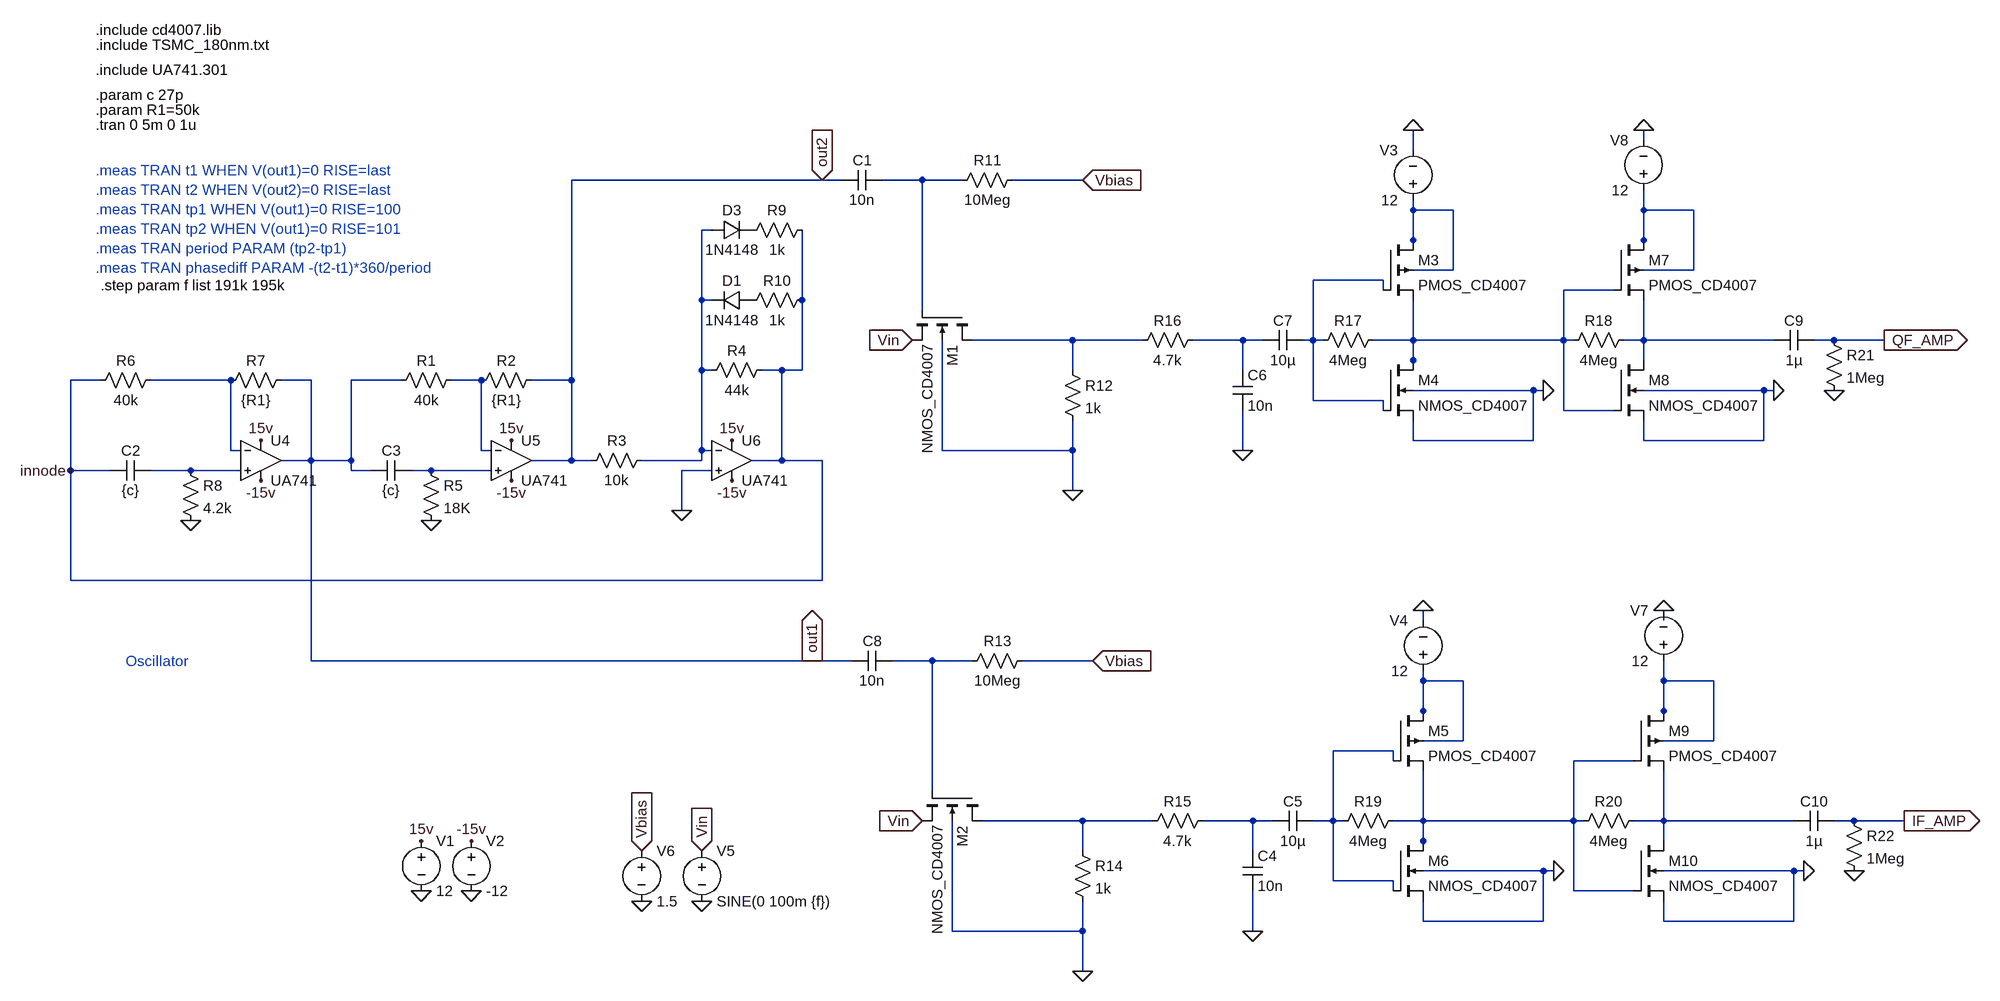
[diagram p0: schematic amplified_output_QDC.asc]
amplified_output_QDC.asc, the LTspice schematic file:
Version 4.1
SHEET 1 3980 1540
WIRE 2224 -368 2224 -384
WIRE 1856 -352 1856 -384
WIRE 912 -304 512 -304
WIRE 944 -304 912 -304
WIRE 1072 -304 1008 -304
WIRE 1136 -304 1072 -304
WIRE 1328 -304 1216 -304
WIRE 1856 -256 1856 -272
WIRE 1920 -256 1856 -256
WIRE 2224 -256 2224 -288
WIRE 2304 -256 2224 -256
WIRE 736 -224 720 -224
WIRE 1856 -208 1856 -256
WIRE 2224 -208 2224 -256
WIRE 1856 -192 1856 -208
WIRE 2224 -192 2224 -208
WIRE 1920 -160 1920 -256
WIRE 1920 -160 1856 -160
WIRE 2304 -160 2304 -256
WIRE 2304 -160 2224 -160
WIRE 1808 -144 1696 -144
WIRE 1808 -128 1808 -144
WIRE 2176 -128 2096 -128
WIRE 720 -112 720 -224
WIRE 736 -112 720 -112
WIRE 880 -112 880 -224
WIRE 1072 -96 1072 -304
WIRE 1312 -48 1152 -48
WIRE 1424 -48 1312 -48
WIRE 1584 -48 1504 -48
WIRE 1616 -48 1584 -48
WIRE 1696 -48 1696 -144
WIRE 1696 -48 1680 -48
WIRE 1712 -48 1696 -48
WIRE 1856 -48 1856 -112
WIRE 1856 -48 1792 -48
WIRE 2096 -48 2096 -128
WIRE 2096 -48 1856 -48
WIRE 2112 -48 2096 -48
WIRE 2224 -48 2224 -112
WIRE 2224 -48 2192 -48
WIRE 2432 -48 2224 -48
WIRE 2528 -48 2496 -48
WIRE 2608 -48 2528 -48
WIRE 1856 -16 1856 -48
WIRE 2224 -16 2224 -48
WIRE 720 0 720 -112
WIRE 736 0 720 0
WIRE 848 0 816 0
WIRE 880 0 880 -112
WIRE 880 0 848 0
WIRE 1312 0 1312 -48
WIRE 1584 0 1584 -48
WIRE 1856 0 1856 -16
WIRE -240 16 -288 16
WIRE -32 16 -160 16
WIRE 96 16 48 16
WIRE 240 16 160 16
WIRE 368 16 320 16
WIRE 512 16 512 -304
WIRE 512 16 448 16
WIRE 2048 32 1856 32
WIRE 2064 32 2048 32
WIRE 2416 32 2224 32
WIRE 2432 32 2416 32
WIRE 1696 48 1696 -48
WIRE 1808 48 1696 48
WIRE 1808 64 1808 48
WIRE 2096 64 2096 -48
WIRE 2176 64 2096 64
WIRE 1856 112 1856 80
WIRE 2048 112 2048 32
WIRE 2048 112 1856 112
WIRE 2224 112 2224 80
WIRE 2416 112 2416 32
WIRE 2416 112 2224 112
WIRE -32 128 -32 16
WIRE -16 128 -32 128
WIRE 368 128 368 16
WIRE 384 128 368 128
WIRE 720 128 720 0
WIRE 736 128 720 128
WIRE 1104 128 1104 -48
WIRE 1312 128 1312 80
WIRE 1312 128 1104 128
WIRE 1584 128 1584 64
WIRE 96 144 96 16
WIRE 96 144 48 144
WIRE 160 144 160 16
WIRE 160 144 96 144
WIRE 512 144 512 16
WIRE 512 144 448 144
WIRE 544 144 512 144
WIRE 720 144 720 128
WIRE 720 144 624 144
WIRE 848 144 848 0
WIRE 848 144 800 144
WIRE 912 144 848 144
WIRE -288 160 -288 16
WIRE -224 160 -288 160
WIRE -96 160 -160 160
WIRE -16 160 -96 160
WIRE 160 160 160 144
WIRE 192 160 160 160
WIRE 288 160 256 160
WIRE 384 160 288 160
WIRE 736 160 688 160
WIRE 1312 192 1312 128
WIRE 688 224 688 160
WIRE -288 336 -288 160
WIRE 912 336 912 144
WIRE 912 336 -288 336
WIRE 1872 400 1872 384
WIRE 2256 400 2256 384
WIRE 96 464 96 144
WIRE 896 464 96 464
WIRE 960 464 896 464
WIRE 1088 464 1024 464
WIRE 1152 464 1088 464
WIRE 1344 464 1232 464
WIRE 1872 496 1872 480
WIRE 1936 496 1872 496
WIRE 2256 496 2256 464
WIRE 2336 496 2256 496
WIRE 1872 544 1872 496
WIRE 2256 544 2256 496
WIRE 1872 560 1872 544
WIRE 2256 560 2256 544
WIRE 1936 592 1936 496
WIRE 1936 592 1872 592
WIRE 2336 592 2336 496
WIRE 2336 592 2256 592
WIRE 1824 608 1728 608
WIRE 1824 624 1824 608
WIRE 2208 624 2112 624
WIRE 1088 672 1088 464
WIRE 1328 720 1168 720
WIRE 1440 720 1328 720
WIRE 1600 720 1520 720
WIRE 1632 720 1600 720
WIRE 1728 720 1728 608
WIRE 1728 720 1696 720
WIRE 1744 720 1728 720
WIRE 1872 720 1872 640
WIRE 1872 720 1824 720
WIRE 2112 720 2112 624
WIRE 2112 720 1872 720
WIRE 2128 720 2112 720
WIRE 2256 720 2256 640
WIRE 2256 720 2208 720
WIRE 2464 720 2256 720
WIRE 2560 720 2528 720
WIRE 2640 720 2560 720
WIRE 1872 752 1872 720
WIRE 2256 752 2256 720
WIRE 1328 768 1328 720
WIRE 1600 768 1600 720
WIRE 1872 768 1872 752
WIRE 2064 800 1872 800
WIRE 2080 800 2064 800
WIRE 2464 800 2256 800
WIRE 2480 800 2464 800
WIRE 1728 816 1728 720
WIRE 1824 816 1728 816
WIRE 1824 832 1824 816
WIRE 2112 832 2112 720
WIRE 2208 832 2112 832
WIRE 1872 880 1872 848
WIRE 2064 880 2064 800
WIRE 2064 880 1872 880
WIRE 2256 880 2256 848
WIRE 2464 880 2464 800
WIRE 2464 880 2256 880
WIRE 1120 896 1120 720
WIRE 1328 896 1328 848
WIRE 1328 896 1120 896
WIRE 1600 896 1600 832
WIRE 1328 960 1328 896
FLAG 688 224 0
FLAG 288 240 0
FLAG -96 240 0
FLAG 272 752 15v
FLAG 16 112 15v
FLAG 416 112 15v
FLAG 768 112 15v
FLAG 352 752 -15v
FLAG 768 176 -15v
FLAG 272 832 0
FLAG 352 832 0
FLAG 16 176 -15v
FLAG 416 176 -15v
FLAG 912 -304 out2
IOPIN 912 -304 In
FLAG 1328 -304 Vbias
IOPIN 1328 -304 In
FLAG 1056 -48 Vin
IOPIN 1056 -48 In
FLAG 1312 192 0
FLAG 1856 -384 0
FLAG 2064 32 0
FLAG 2640 720 IF_AMP
IOPIN 2640 720 Out
FLAG 720 848 0
FLAG 720 768 Vin
IOPIN 720 768 In
FLAG 624 848 0
FLAG 624 768 Vbias
IOPIN 624 768 In
FLAG -288 160 innode
FLAG 1584 128 0
FLAG 2224 -384 0
FLAG 2432 32 0
FLAG 2608 -48 QF_AMP
IOPIN 2608 -48 Out
FLAG 1344 464 Vbias
IOPIN 1344 464 In
FLAG 1072 720 Vin
IOPIN 1072 720 In
FLAG 1328 960 0
FLAG 1872 384 0
FLAG 2080 800 0
FLAG 1600 896 0
FLAG 2256 384 0
FLAG 2480 800 0
FLAG 896 464 out1
IOPIN 896 464 Out
FLAG 2528 32 0
FLAG 2560 800 0
SYMBOL res 336 0 R90
WINDOW 0 0 56 VBottom 2
WINDOW 3 32 56 VTop 2
SYMATTR InstName R1
SYMATTR Value 40k
SYMBOL res 464 0 R90
WINDOW 0 0 56 VBottom 2
WINDOW 3 32 56 VTop 2
SYMATTR InstName R2
SYMATTR Value {R1}
SYMBOL res 640 128 R90
WINDOW 0 0 56 VBottom 2
WINDOW 3 32 56 VTop 2
SYMATTR InstName R3
SYMATTR Value 10k
SYMBOL res 832 -16 R90
WINDOW 0 0 56 VBottom 2
WINDOW 3 32 56 VTop 2
SYMATTR InstName R4
SYMATTR Value 44k
SYMBOL res 272 144 R0
SYMATTR InstName R5
SYMATTR Value 18K
SYMBOL res -144 0 R90
WINDOW 0 0 56 VBottom 2
WINDOW 3 32 56 VTop 2
SYMATTR InstName R6
SYMATTR Value 40k
SYMBOL res 64 0 R90
WINDOW 0 0 56 VBottom 2
WINDOW 3 32 56 VTop 2
SYMATTR InstName R7
SYMATTR Value {R1}
SYMBOL cap -160 144 R90
WINDOW 0 0 32 VBottom 2
WINDOW 3 32 32 VTop 2
SYMATTR InstName C2
SYMATTR Value {c}
SYMBOL res -112 144 R0
SYMATTR InstName R8
SYMATTR Value 4.2k
SYMBOL voltage 272 736 R0
SYMATTR InstName V1
SYMATTR Value 12
SYMBOL voltage 352 736 R0
WINDOW 123 0 0 Left 0
WINDOW 39 0 0 Left 0
SYMATTR InstName V2
SYMATTR Value -12
SYMBOL cap 256 144 R90
WINDOW 0 0 32 VBottom 2
WINDOW 3 32 32 VTop 2
SYMATTR InstName C3
SYMATTR Value {c}
SYMBOL diode 800 -128 R90
WINDOW 0 0 32 VBottom 2
WINDOW 3 32 32 VTop 2
SYMATTR InstName D1
SYMATTR Value 1N4148
SYMBOL diode 736 -208 R270
WINDOW 0 32 32 VTop 2
WINDOW 3 0 32 VBottom 2
SYMATTR InstName D3
SYMATTR Value 1N4148
SYMBOL res 896 -240 R90
WINDOW 0 0 56 VBottom 2
WINDOW 3 32 56 VTop 2
SYMATTR InstName R9
SYMATTR Value 1k
SYMBOL res 896 -128 R90
WINDOW 0 0 56 VBottom 2
WINDOW 3 32 56 VTop 2
SYMATTR InstName R10
SYMATTR Value 1k
SYMBOL res 1232 -320 R90
WINDOW 0 0 56 VBottom 2
WINDOW 3 32 56 VTop 2
SYMATTR InstName R11
SYMATTR Value 10Meg
SYMBOL nmos4 1152 -96 R90
SYMATTR InstName M1
SYMATTR Value NMOS_CD4007
SYMATTR Value2 L=5u W=170u Ad=8500p As=8500p Pd=440u Ps=440u NRD=0.1 NRS=0.1
SYMBOL res 1296 -16 R0
SYMATTR InstName R12
SYMATTR Value 1k
SYMBOL res 1520 -64 R90
WINDOW 0 0 56 VBottom 2
WINDOW 3 32 56 VTop 2
SYMATTR InstName R16
SYMATTR Value 4.7k
SYMBOL cap 1568 0 R0
SYMATTR InstName C6
SYMATTR Value 10n
SYMBOL cap 1680 -64 R90
WINDOW 0 0 32 VBottom 2
WINDOW 3 32 32 VTop 2
SYMATTR InstName C7
SYMATTR Value 10µ
SYMBOL voltage 1856 -256 R180
WINDOW 0 24 96 Left 2
WINDOW 3 24 16 Left 2
WINDOW 123 0 0 Left 0
WINDOW 39 0 0 Left 0
SYMATTR InstName V3
SYMATTR Value 12
SYMBOL pmos4 1808 -208 R0
SYMATTR InstName M3
SYMATTR Value PMOS_CD4007
SYMATTR Value2 L=5u W=360u Ad=18000p As=18000p Pd=820u Ps=820u NRS=0.54 NRD=0.54
SYMBOL nmos4 1808 -16 R0
SYMATTR InstName M4
SYMATTR Value NMOS_CD4007
SYMATTR Value2 L=5u W=170u Ad=8500p As=8500p Pd=440u Ps=440u NRD=0.1 NRS=0.1
SYMBOL voltage 720 752 R0
WINDOW 123 0 0 Left 0
WINDOW 39 0 0 Left 0
SYMATTR InstName V5
SYMATTR Value SINE(0 100m {f})
SYMBOL voltage 624 752 R0
WINDOW 123 0 0 Left 0
WINDOW 39 0 0 Left 0
SYMATTR InstName V6
SYMATTR Value 1.5
SYMBOL opamp\\UA741 16 80 R0
SYMATTR InstName U4
SYMBOL opamp\\UA741 416 80 R0
SYMATTR InstName U5
SYMBOL opamp\\UA741 768 80 R0
SYMATTR InstName U6
SYMBOL res 1808 -64 R90
WINDOW 0 0 56 VBottom 2
WINDOW 3 32 56 VTop 2
SYMATTR InstName R17
SYMATTR Value 4Meg
SYMBOL cap 1008 -320 R90
WINDOW 0 0 32 VBottom 2
WINDOW 3 32 32 VTop 2
SYMATTR InstName C1
SYMATTR Value 10n
SYMBOL voltage 2224 -272 R180
WINDOW 0 24 96 Left 2
WINDOW 3 24 16 Left 2
WINDOW 123 0 0 Left 0
WINDOW 39 0 0 Left 0
SYMATTR InstName V8
SYMATTR Value 12
SYMBOL pmos4 2176 -208 R0
SYMATTR InstName M7
SYMATTR Value PMOS_CD4007
SYMATTR Value2 L=5u W=360u Ad=18000p As=18000p Pd=820u Ps=820u NRS=0.54 NRD=0.54
SYMBOL nmos4 2176 -16 R0
SYMATTR InstName M8
SYMATTR Value NMOS_CD4007
SYMATTR Value2 L=5u W=170u Ad=8500p As=8500p Pd=440u Ps=440u NRD=0.1 NRS=0.1
SYMBOL res 2208 -64 R90
WINDOW 0 0 56 VBottom 2
WINDOW 3 32 56 VTop 2
SYMATTR InstName R18
SYMATTR Value 4Meg
SYMBOL res 1248 448 R90
WINDOW 0 0 56 VBottom 2
WINDOW 3 32 56 VTop 2
SYMATTR InstName R13
SYMATTR Value 10Meg
SYMBOL nmos4 1168 672 R90
SYMATTR InstName M2
SYMATTR Value NMOS_CD4007
SYMATTR Value2 L=5u W=170u Ad=8500p As=8500p Pd=440u Ps=440u NRD=0.1 NRS=0.1
SYMBOL res 1312 752 R0
SYMATTR InstName R14
SYMATTR Value 1k
SYMBOL res 1536 704 R90
WINDOW 0 0 56 VBottom 2
WINDOW 3 32 56 VTop 2
SYMATTR InstName R15
SYMATTR Value 4.7k
SYMBOL cap 1584 768 R0
SYMATTR InstName C4
SYMATTR Value 10n
SYMBOL cap 1696 704 R90
WINDOW 0 0 32 VBottom 2
WINDOW 3 32 32 VTop 2
SYMATTR InstName C5
SYMATTR Value 10µ
SYMBOL voltage 1872 496 R180
WINDOW 0 24 96 Left 2
WINDOW 3 24 16 Left 2
WINDOW 123 0 0 Left 0
WINDOW 39 0 0 Left 0
SYMATTR InstName V4
SYMATTR Value 12
SYMBOL pmos4 1824 544 R0
SYMATTR InstName M5
SYMATTR Value PMOS_CD4007
SYMATTR Value2 L=5u W=360u Ad=18000p As=18000p Pd=820u Ps=820u NRS=0.54 NRD=0.54
SYMBOL nmos4 1824 752 R0
SYMATTR InstName M6
SYMATTR Value NMOS_CD4007
SYMATTR Value2 L=5u W=170u Ad=8500p As=8500p Pd=440u Ps=440u NRD=0.1 NRS=0.1
SYMBOL res 1840 704 R90
WINDOW 0 0 56 VBottom 2
WINDOW 3 32 56 VTop 2
SYMATTR InstName R19
SYMATTR Value 4Meg
SYMBOL cap 1024 448 R90
WINDOW 0 0 32 VBottom 2
WINDOW 3 32 32 VTop 2
SYMATTR InstName C8
SYMATTR Value 10n
SYMBOL voltage 2256 480 R180
WINDOW 0 24 96 Left 2
WINDOW 3 24 16 Left 2
WINDOW 123 0 0 Left 0
WINDOW 39 0 0 Left 0
SYMATTR InstName V7
SYMATTR Value 12
SYMBOL pmos4 2208 544 R0
SYMATTR InstName M9
SYMATTR Value PMOS_CD4007
SYMATTR Value2 L=5u W=360u Ad=18000p As=18000p Pd=820u Ps=820u NRS=0.54 NRD=0.54
SYMBOL nmos4 2208 752 R0
SYMATTR InstName M10
SYMATTR Value NMOS_CD4007
SYMATTR Value2 L=5u W=170u Ad=8500p As=8500p Pd=440u Ps=440u NRD=0.1 NRS=0.1
SYMBOL res 2224 704 R90
WINDOW 0 0 56 VBottom 2
WINDOW 3 32 56 VTop 2
SYMATTR InstName R20
SYMATTR Value 4Meg
SYMBOL cap 2496 -64 R90
WINDOW 0 0 32 VBottom 2
WINDOW 3 32 32 VTop 2
SYMATTR InstName C9
SYMATTR Value 1µ
SYMBOL cap 2528 704 R90
WINDOW 0 0 32 VBottom 2
WINDOW 3 32 32 VTop 2
SYMATTR InstName C10
SYMATTR Value 1µ
SYMBOL res 2512 -64 R0
SYMATTR InstName R21
SYMATTR Value 1Meg
SYMBOL res 2544 704 R0
SYMATTR InstName R22
SYMATTR Value 1Meg
TEXT -248 -392 Left 2 !.tran 0 5m 0 1u
TEXT -248 -416 Left 2 !.param R1=50k
TEXT -248 -320 Left 2 ;.meas TRAN t1 WHEN V(out1)=0 RISE=last\n.meas TRAN t2 WHEN V(out2)=0 RISE=last\n.meas TRAN tp1 WHEN V(out1)=0 RISE=100\n.meas TRAN tp2 WHEN V(out1)=0 RISE=101\n.meas TRAN period PARAM (tp2-tp1)\n.meas TRAN phasediff PARAM -(t2-t1)*360/period
TEXT -248 -440 Left 2 !.param c 27p
TEXT -200 464 Left 2 ;Oscillator
TEXT -248 -480 Left 2 !.include UA741.301
TEXT -248 -520 Left 2 !.include TSMC_180nm.txt
TEXT -248 -544 Left 2 !.include cd4007.lib
TEXT -240 -136 Left 2 !.step param f list 191k 195k

The netlist it stands for:
* amplified_output_QDC.asc
R1 N011 out1 40k
R2 out2 N011 {R1}
R3 N004 out2 10k
R4 innode N004 44k
R5 N013 0 18K
R6 N010 innode 40k
R7 out1 N010 {R1}
C2 N012 innode {c}
R8 N012 0 4.2k
V1 15v 0 12
V2 -15v 0 -12
C3 N013 out1 {c}
D1 P001 N004 1N4148
D3 N004 P002 1N4148
R9 innode P002 1k
R10 innode P001 1k
R11 Vbias N001 10Meg
M1 N007 N001 Vin 0 NMOS_CD4007 L=5u W=170u Ad=8500p As=8500p Pd=440u Ps=440u NRD=0.1 NRS=0.1
R12 N007 0 1k
R16 N008 N007 4.7k
C6 N008 0 10n
C7 N005 N008 10µ
V3 N002 0 12
M3 N002 N005 N006 N002 PMOS_CD4007 L=5u W=360u Ad=18000p As=18000p Pd=820u Ps=820u NRS=0.54 NRD=0.54
M4 N006 N005 0 0 NMOS_CD4007 L=5u W=170u Ad=8500p As=8500p Pd=440u Ps=440u NRD=0.1 NRS=0.1
V5 Vin 0 SINE(0 100m {f})
V6 Vbias 0 1.5
* U4: UA741 (symbol opamp\UA741 not available, pins judged from their places): In+=N012 In-=N010 V+=15v V-=-15v OUT=out1
* U5: UA741 (symbol opamp\UA741 not available, pins judged from their places): In+=N013 In-=N011 V+=15v V-=-15v OUT=out2
* U6: UA741 (symbol opamp\UA741 not available, pins judged from their places): In+=0 In-=N004 V+=15v V-=-15v OUT=innode
R17 N006 N005 4Meg
C1 N001 out2 10n
V8 N003 0 12
M7 N003 N006 N009 N003 PMOS_CD4007 L=5u W=360u Ad=18000p As=18000p Pd=820u Ps=820u NRS=0.54 NRD=0.54
M8 N009 N006 0 0 NMOS_CD4007 L=5u W=170u Ad=8500p As=8500p Pd=440u Ps=440u NRD=0.1 NRS=0.1
R18 N009 N006 4Meg
R13 Vbias N014 10Meg
M2 N019 N014 Vin 0 NMOS_CD4007 L=5u W=170u Ad=8500p As=8500p Pd=440u Ps=440u NRD=0.1 NRS=0.1
R14 N019 0 1k
R15 N020 N019 4.7k
C4 N020 0 10n
C5 N017 N020 10µ
V4 N015 0 12
M5 N015 N017 N018 N015 PMOS_CD4007 L=5u W=360u Ad=18000p As=18000p Pd=820u Ps=820u NRS=0.54 NRD=0.54
M6 N018 N017 0 0 NMOS_CD4007 L=5u W=170u Ad=8500p As=8500p Pd=440u Ps=440u NRD=0.1 NRS=0.1
R19 N018 N017 4Meg
C8 N014 out1 10n
V7 N016 0 12
M9 N016 N018 N021 N016 PMOS_CD4007 L=5u W=360u Ad=18000p As=18000p Pd=820u Ps=820u NRS=0.54 NRD=0.54
M10 N021 N018 0 0 NMOS_CD4007 L=5u W=170u Ad=8500p As=8500p Pd=440u Ps=440u NRD=0.1 NRS=0.1
R20 N021 N018 4Meg
C9 QF_AMP N009 1µ
C10 IF_AMP N021 1µ
R21 QF_AMP 0 1Meg
R22 IF_AMP 0 1Meg
.model D D
.lib standard.dio
.model NMOS NMOS
.model PMOS PMOS
.lib standard.mos
.tran 0 5m 0 1u
.param R1=50k
* .meas TRAN t1 WHEN V(out1)=0 RISE=last
* .meas TRAN t2 WHEN V(out2)=0 RISE=last
* .meas TRAN tp1 WHEN V(out1)=0 RISE=100
* .meas TRAN tp2 WHEN V(out1)=0 RISE=101
* .meas TRAN period PARAM (tp2-tp1)
* .meas TRAN phasediff PARAM -(t2-t1)*360/period
.param c 27p
* Oscillator
.include UA741.301
.include TSMC_180nm.txt
.include cd4007.lib
.step param f list 191k 195k
.backanno
.end